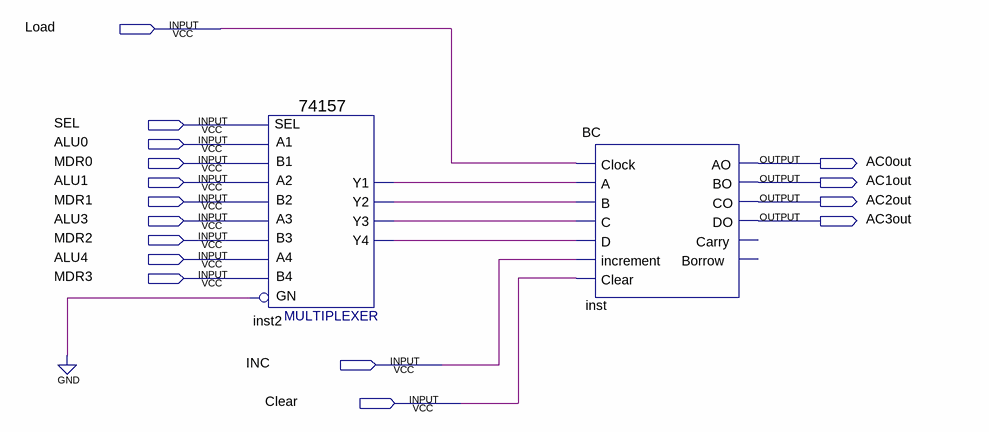
[diagram p0: schematic sheet]
// Quartus schematic Accumulator.bdf as structural Verilog: 2 symbols, 16 pins
module Accumulator (
  input  Load,
  input  SEL,
  input  ALU0,
  input  MDR0,
  input  ALU1,
  input  MDR1,
  input  ALU3,
  input  MDR2,
  input  ALU4,
  input  MDR3,
  input  INC,
  input  Clear,
  output AC0out,
  output AC1out,
  output AC2out,
  output AC3out
);

  wire inst2_y1, inst2_y2, inst2_y3, inst2_y4;

  \74157  inst2 (
    .A1(ALU0), .B1(MDR0), .SEL(SEL), .B2(MDR1), .A3(ALU3), .B3(MDR2), .A2(ALU1), .B4(MDR3), .GN(1'b0),
    .A4(ALU4), .Y2(inst2_y2), .Y1(inst2_y1), .Y4(inst2_y4), .Y3(inst2_y3));
  BC inst (
    .Clock(Load), .A(inst2_y1), .B(inst2_y2), .C(inst2_y3), .D(inst2_y4), .increment(INC), .Clear(Clear),
    .AO(AC0out), .BO(AC1out), .CO(AC2out), .DO(AC3out));  // open: Carry, Borrow
endmodule
